# EAGLE schematic Thermal_Stage_rev5 (EAGLE 5.06)

## Sheet 1 of 2
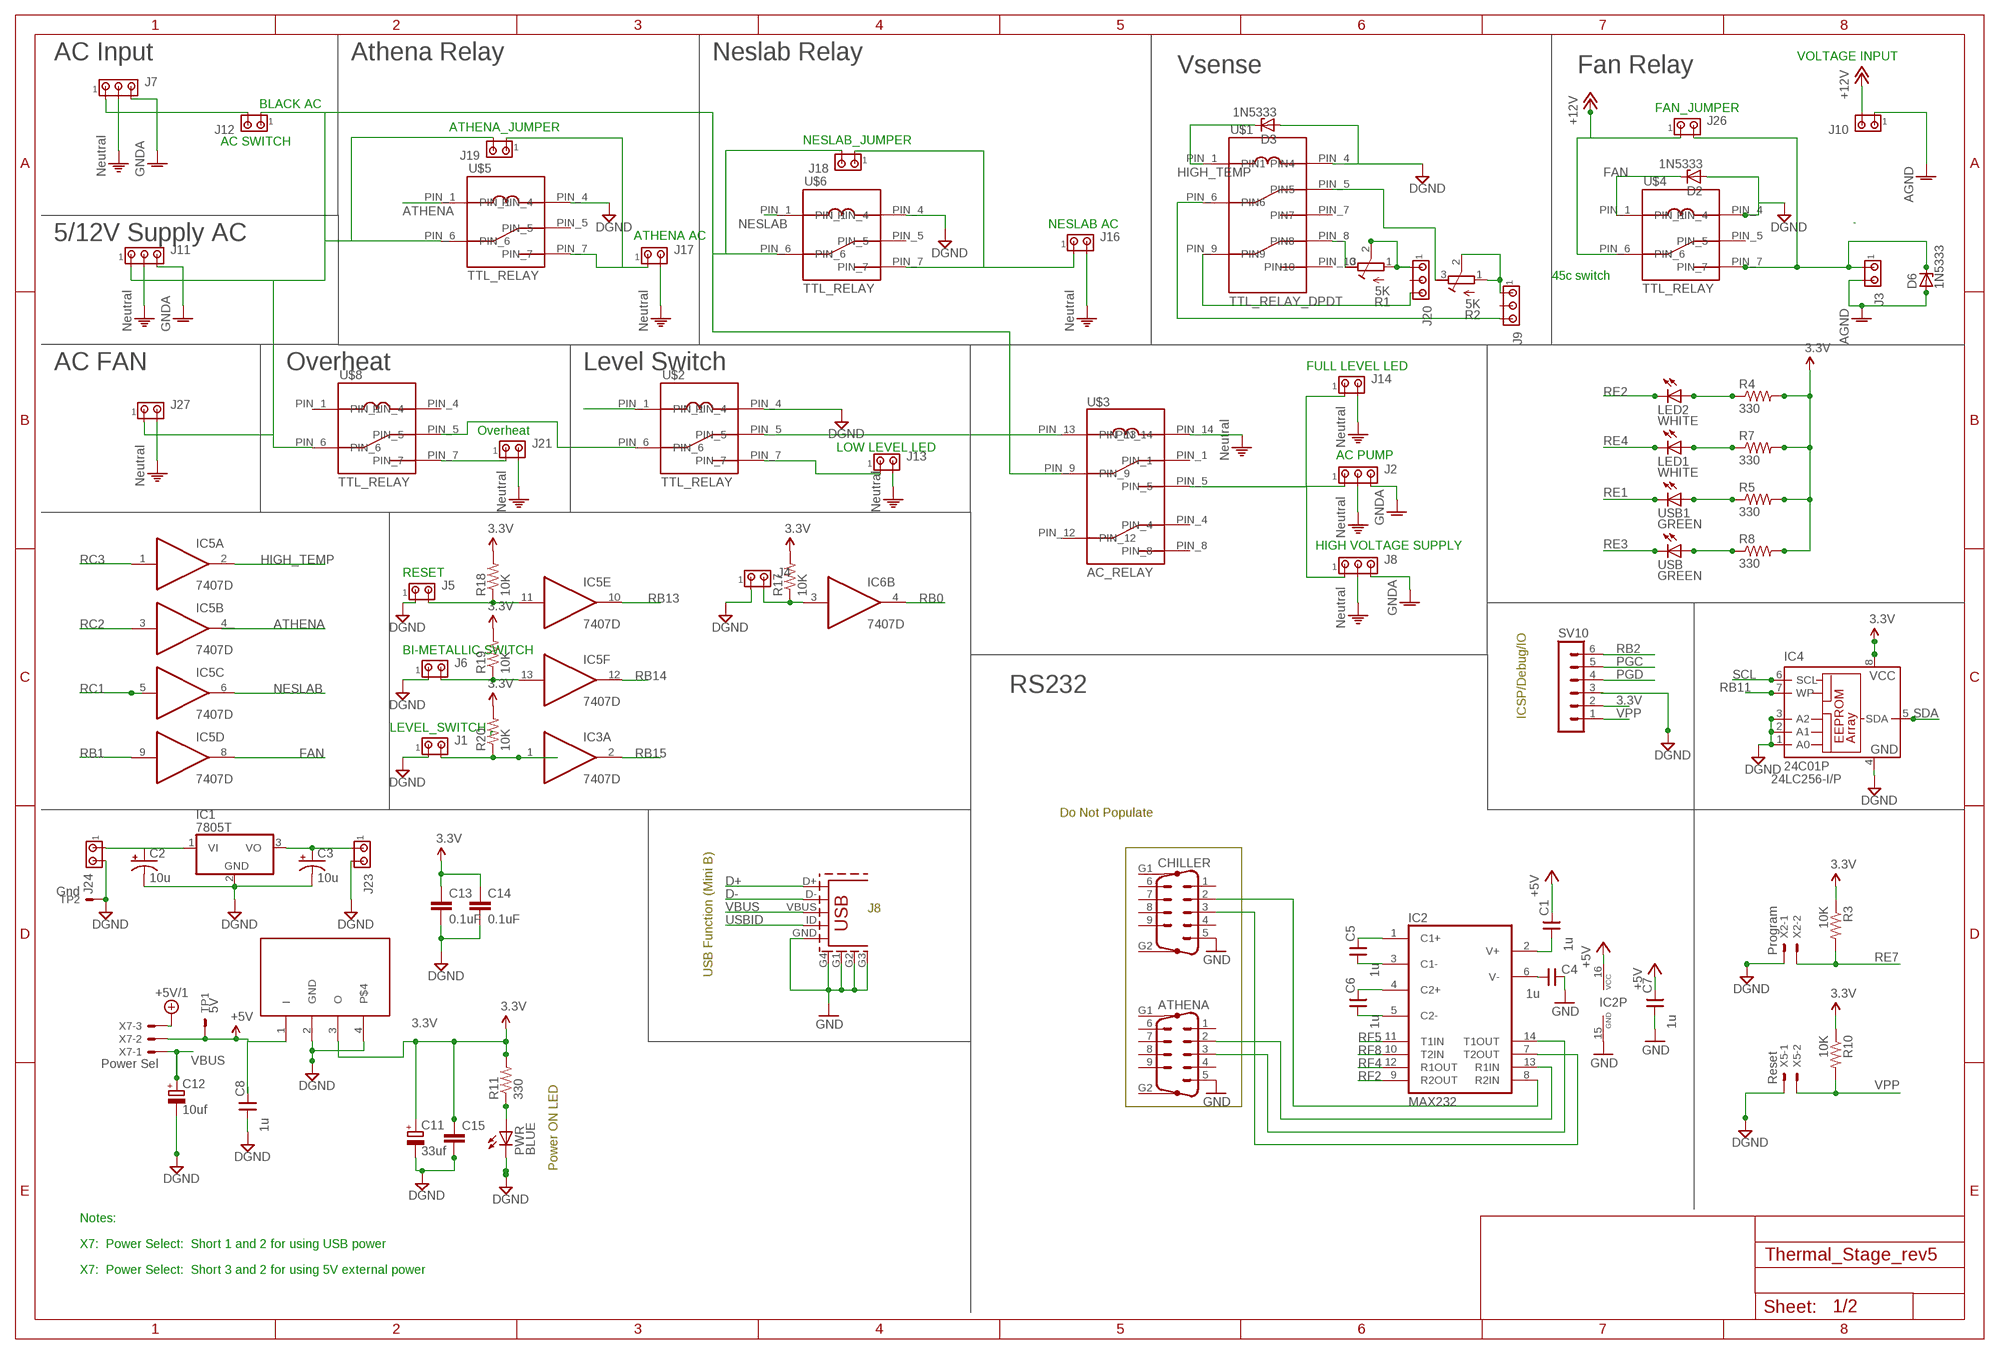
[diagram p0: schematic, sheet 1]

### Parts
ATHENA  M09HP  [M09HP]
C1  1u  CNP-C025-050X025  [C025-050X025]
C2  10u  CPOL-USE2,5-6E  [E2,5-6E]
C3  10u  CPOL-USE2,5-6E  [E2,5-6E]
C4  1u  CNP-C025-050X025  [C025-050X025]
C5  1u  CNP-C025-050X025  [C025-050X025]
C6  1u  CNP-C025-050X025  [C025-050X025]
C7  1u  CNP-C025-050X025  [C025-050X025]
C8  1u  CNP-C025-050X025  [C025-050X025]
C11  33uf  CPOL-EUE5-4  [E5-4]
C12  10uf  CPOL-EUE5-4  [E5-4]
C13  0.1uF  CAP0402  [C0402]
C14  0.1uF  CAP0402-CAP  [0402-CAP]
C15  C5/3  [C5B3]
CHILLER  M09HP  [M09HP]
D2  1N5333  [C1702-15]
D3  1N5333  [C1702-15]
D6  1N5333  [C1702-15]
IC1  7805T  [TO220H]
IC2  MAX232  [DIL16]
IC3  7407D  [SO14]
IC4  24C01P  [DIL8]
IC5  7407D  [SO14]
IC6  7407D  [SO14]
J1  MTA02-156  [1X2MTA]
J2  MTA03-156  [1X3MTA]
J3  MTA02-156  [1X2MTA]
J4  MTA02-156  [1X2MTA]
J5  MTA02-156  [1X2MTA]
J6  MTA02-156  [1X2MTA]
J7  MTA03-156  [1X3MTA]
J8  MTA03-156  [1X3MTA]
J9  MTA03-100  [10X03MTA]
J10  MTA02-156  [1X2MTA]
J11  MTA03-156  [1X3MTA]
J12  MTA02-156  [1X2MTA]
J13  MTA02-156  [1X2MTA]
J14  MTA02-156  [1X2MTA]
J16  MTA02-156  [1X2MTA]
J17  MTA02-156  [1X2MTA]
J18  MTA02-100  [10X02MTA]
J19  MTA02-100  [10X02MTA]
J20  MTA03-100  [10X03MTA]
J21  MTA02-156  [1X2MTA]
J23  MTA02-100  [10X02MTA]
J24  MTA02-100  [10X02MTA]
J26  MTA02-100  [10X02MTA]
J27  MTA02-156  [1X2MTA]
LED1  WHITE  LED0603  [LED-0603]
LED2  WHITE  LED0603  [LED-0603]
PWR  BLUE  LED0603  [LED-0603]
R1  5K  R-TRIMM3296W  [RTRIM3296W]
R2  5K  R-TRIMM3296W  [RTRIM3296W]
R3  10K  RESISTOR0402-RES  [0402-RES]
R4  330  RESISTOR0402-RES  [0402-RES]
R5  330  RESISTOR0402-RES  [0402-RES]
R7  330  RESISTOR0402-RES  [0402-RES]
R8  330  RESISTOR0402-RES  [0402-RES]
R10  10K  RESISTOR0402-RES  [0402-RES]
R11  330  RESISTOR0402-RES  [0402-RES]
R17  10K  RESISTOR0402-RES  [0402-RES]
R18  10K  RESISTOR0402-RES  [0402-RES]
R19  10K  RESISTOR0402-RES  [0402-RES]
R20  10K  RESISTOR0402-RES  [0402-RES]
SV10  MA06-1  [MA06-1]
TP1  5V  TESTPOINT  [TESTPOINT]
TP2  Gnd  TESTPOINT  [TESTPOINT]
U3  USB_5PINB  [USB-MINIB]
U$1  TTL_RELAY_DPDT  [TTL_RELAY_DPDT]
U$2  TTL_RELAY  [R1OS-E1Y1-J1.0K]
U$3  AC_RELAY  [70-402-1]
U$4  TTL_RELAY  [R1OS-E1Y1-J1.0K]
U$5  TTL_RELAY  [R1OS-E1Y1-J1.0K]
U$6  TTL_RELAY  [R1OS-E1Y1-J1.0K]
U$8  TTL_RELAY  [R1OS-E1Y1-J1.0K]
U$9  3.3VREG  [SOT223]
USB  GREEN  LED0603  [LED-0603]
USB1  GREEN  LED0603  [LED-0603]
X2  Program  22-23-2021  [22-23-2021]
X5  Reset  22-23-2021  [22-23-2021]
X7  Power Sel  22-23-2031  [22-23-2031]

### Nets
3.3V: C11.+ C13.1 C14.1 C15.1 IC4.8(VCC) R3.1 R4.2 R5.2 R7.2 R8.2 R10.1 R11.2 R17.2 R18.2 R19.2 R20.2 SV10.2 U$9.3(O) ; also sheet 2
+5V: C1.2 C7.2 C8.2 IC2.16(VCC) TP1.TP(S) U$9.1(I) X7.2
+5V/1: X7.3
+12V: J10.2 J26.1 U$4.PIN_6
AGND: D6.A J3.2 J10.1
ATHENA: U$5.PIN_1
D+: U3.D+ ; also sheet 2
D-: U3.D- ; also sheet 2
DGND: C2.- C3.- C8.1 C11.- C12.- C13.2 C14.2 C15.2 D2.A D3.A IC1.2(GND) IC4.1(A0) IC4.2(A1) IC4.3(A2) IC4.4(GND) J1.1 J4.1 J6.1 J23.2 J24.2 PWR.C TP2.TP(S) U$1.PIN_4(PIN4) U$2.PIN_4 U$4.PIN_4 U$5.PIN_4 U$6.PIN_4 U$9.2(GND) U$9.4 X2.1 X5.1 ; also sheet 2
FAN: D2.C IC5.8(D:O) U$4.PIN_1
GND: ATHENA.5 C4.2 C7.1 CHILLER.5 IC2.15(GND) U3.G1 U3.G2 U3.G3 U3.G4(SHIELD) U3.GND
GNDA: J2.3 J7.3 J8.3 J11.3
HIGH_TEMP: D3.C IC5.2(A:O) U$1.PIN_1(PIN1)
N$1: D6.C J3.1 J26.2 U$4.PIN_7
N$2: J21.1 U$8.PIN_7
N$3: J20.1 R1.1(E) R1.2(S)
N$4: J5.1 ; supply symbol labelled DGND
N$6: U$2.PIN_5 U$3.PIN_13
N$7: R1.3(A) U$1.PIN_8(PIN8)
N$8: J16.1 J18.1 U$6.PIN_7
N$9: IC5.13(F:I) J6.2 R19.1
N$10: IC3.1(A:I) J1.2 R20.1
N$11: C4.1 IC2.6(V-)
N$12: C1.1 IC2.2(V+)
N$13: J9.3 U$1.PIN_6(PIN6)
N$14: J17.1 J19.1 U$5.PIN_7
N$15: U$2.PIN_1
N$16: U$2.PIN_6 U$8.PIN_5
N$18: C5.2 IC2.1(C1+)
N$19: J20.3 U$1.PIN_9(PIN9)
N$20: C5.1 IC2.3(C1-)
N$21: R2.3(A) U$1.PIN_5(PIN5)
N$22: J9.1 R2.1(E) R2.2(S)
N$23: J11.1 J12.1 J18.2 J19.2 J27.1 U$3.PIN_9 U$5.PIN_6 U$6.PIN_6 U$8.PIN_6
N$24: C2.+ IC1.1(VI) J24.1
N$25: C3.+ IC1.3(VO) J23.1
N$26: C6.2 IC2.4(C2+)
N$27: J2.1 J8.1 J14.1 U$3.PIN_5
N$28: J13.1 U$2.PIN_7
N$29: C6.1 IC2.5(C2-)
N$31: J7.1 J12.2
N$32: ATHENA.2 IC2.13(R1IN)
N$33: ATHENA.3 IC2.14(T1OUT)
N$34: CHILLER.2 IC2.8(R2IN)
N$35: CHILLER.3 IC2.7(T2OUT)
N$36: IC5.11(E:I) J5.2 R18.1
N$37: IC6.3(B:I) J4.2 R17.1
N$43: R8.1 USB.A
N$44: LED1.A R7.1
N$45: PWR.A R11.1
N$47: LED2.A R4.1
N$48: R5.1 USB1.A
NESLAB: IC5.6(C:O) U$6.PIN_1
PE: J2.2 J7.2 J8.2 J11.2 J13.2 J14.2 J16.2 J17.2 J21.2 J27.2 U$3.PIN_14 ; supply symbol labelled Neutral
PGC: SV10.5 ; also sheet 2
PGD: SV10.4 ; also sheet 2
RB0: IC6.4(B:O)
RB1: IC5.9(D:I) ; also sheet 2
RB2: SV10.6 ; also sheet 2
RB11: IC4.7(WP) ; also sheet 2
RB13: IC5.10(E:O) ; also sheet 2
RB14: IC5.12(F:O) ; also sheet 2
RB15: IC3.2(A:O) ; also sheet 2
RC1: IC5.5(C:I) ; also sheet 2
RC2: IC5.3(B:I) ; also sheet 2
RC3: IC5.1(A:I) ; also sheet 2
RE1: USB1.C ; also sheet 2
RE2: LED2.C ; also sheet 2
RE3: USB.C ; also sheet 2
RE4: LED1.C ; also sheet 2
RE7: R3.2 X2.2 ; also sheet 2
RF2: IC2.9(R2OUT) ; also sheet 2
RF4: IC2.12(R1OUT) ; also sheet 2
RF5: IC2.11(T1IN) ; also sheet 2
RF8: IC2.10(T2IN) ; also sheet 2
SCL: IC4.6(SCL) ; also sheet 2
SDA: IC4.5(SDA) ; also sheet 2
USBID: U3.ID(USB_ID) ; also sheet 2
VBUS: C12.+ U3.VBUS X7.1 ; also sheet 2
VPP: R10.2 SV10.1 X5.2 ; also sheet 2
Unconnected: ATHENA.1 ATHENA.4 ATHENA.6 ATHENA.7 ATHENA.8 ATHENA.9 ATHENA.G1 ATHENA.G2 CHILLER.1 CHILLER.4 CHILLER.6 CHILLER.7 CHILLER.8 CHILLER.9 CHILLER.G1 CHILLER.G2 IC3.3(B:I) IC3.4(B:O) IC3.5(C:I) IC3.6(C:O) IC3.8(D:O) IC3.9(D:I) IC3.10(E:O) IC3.11(E:I) IC3.12(F:O) IC3.13(F:I) IC5.4(B:O) IC6.1(A:I) IC6.2(A:O) IC6.5(C:I) IC6.6(C:O) IC6.8(D:O) IC6.9(D:I) IC6.10(E:O) IC6.11(E:I) IC6.12(F:O) IC6.13(F:I) J9.2 J20.2 SV10.3 U$1.PIN_7(PIN7) U$1.PIN_10(PIN10) U$3.PIN_1 U$3.PIN_4 U$3.PIN_8 U$3.PIN_12 U$4.PIN_5 U$5.PIN_5 U$6.PIN_5 U$8.PIN_1 U$8.PIN_4

### Notes on the sheet
- AC Input | Athena Relay | Neslab Relay | VOLTAGE INPUT
- Vsense | Fan Relay
- BLACK AC
- FAN_JUMPER
- ATHENA_JUMPER
- AC SWITCH | NESLAB_JUMPER
- NESLAB AC
- 5/12V Supply AC | ATHENA AC
- 45c switch
- AC FAN | Overheat | Level Switch | FULL LEVEL LED
- Overheat
- LOW LEVEL LED
- AC PUMP
- HIGH VOLTAGE SUPPLY
- RESET
- BI-METALLIC SWITCH
- RS232
- ICSP/Debug/IO
- LEVEL_SWITCH
- 24LC256-I/P
- Do Not Populate
- J8
- USB Function (Mini B)
- Power ON LED
- Notes:
- X7:  Power Select:  Short 1 and 2 for using USB power
- X7:  Power Select:  Short 3 and 2 for using 5V external power

## Sheet 2 of 2
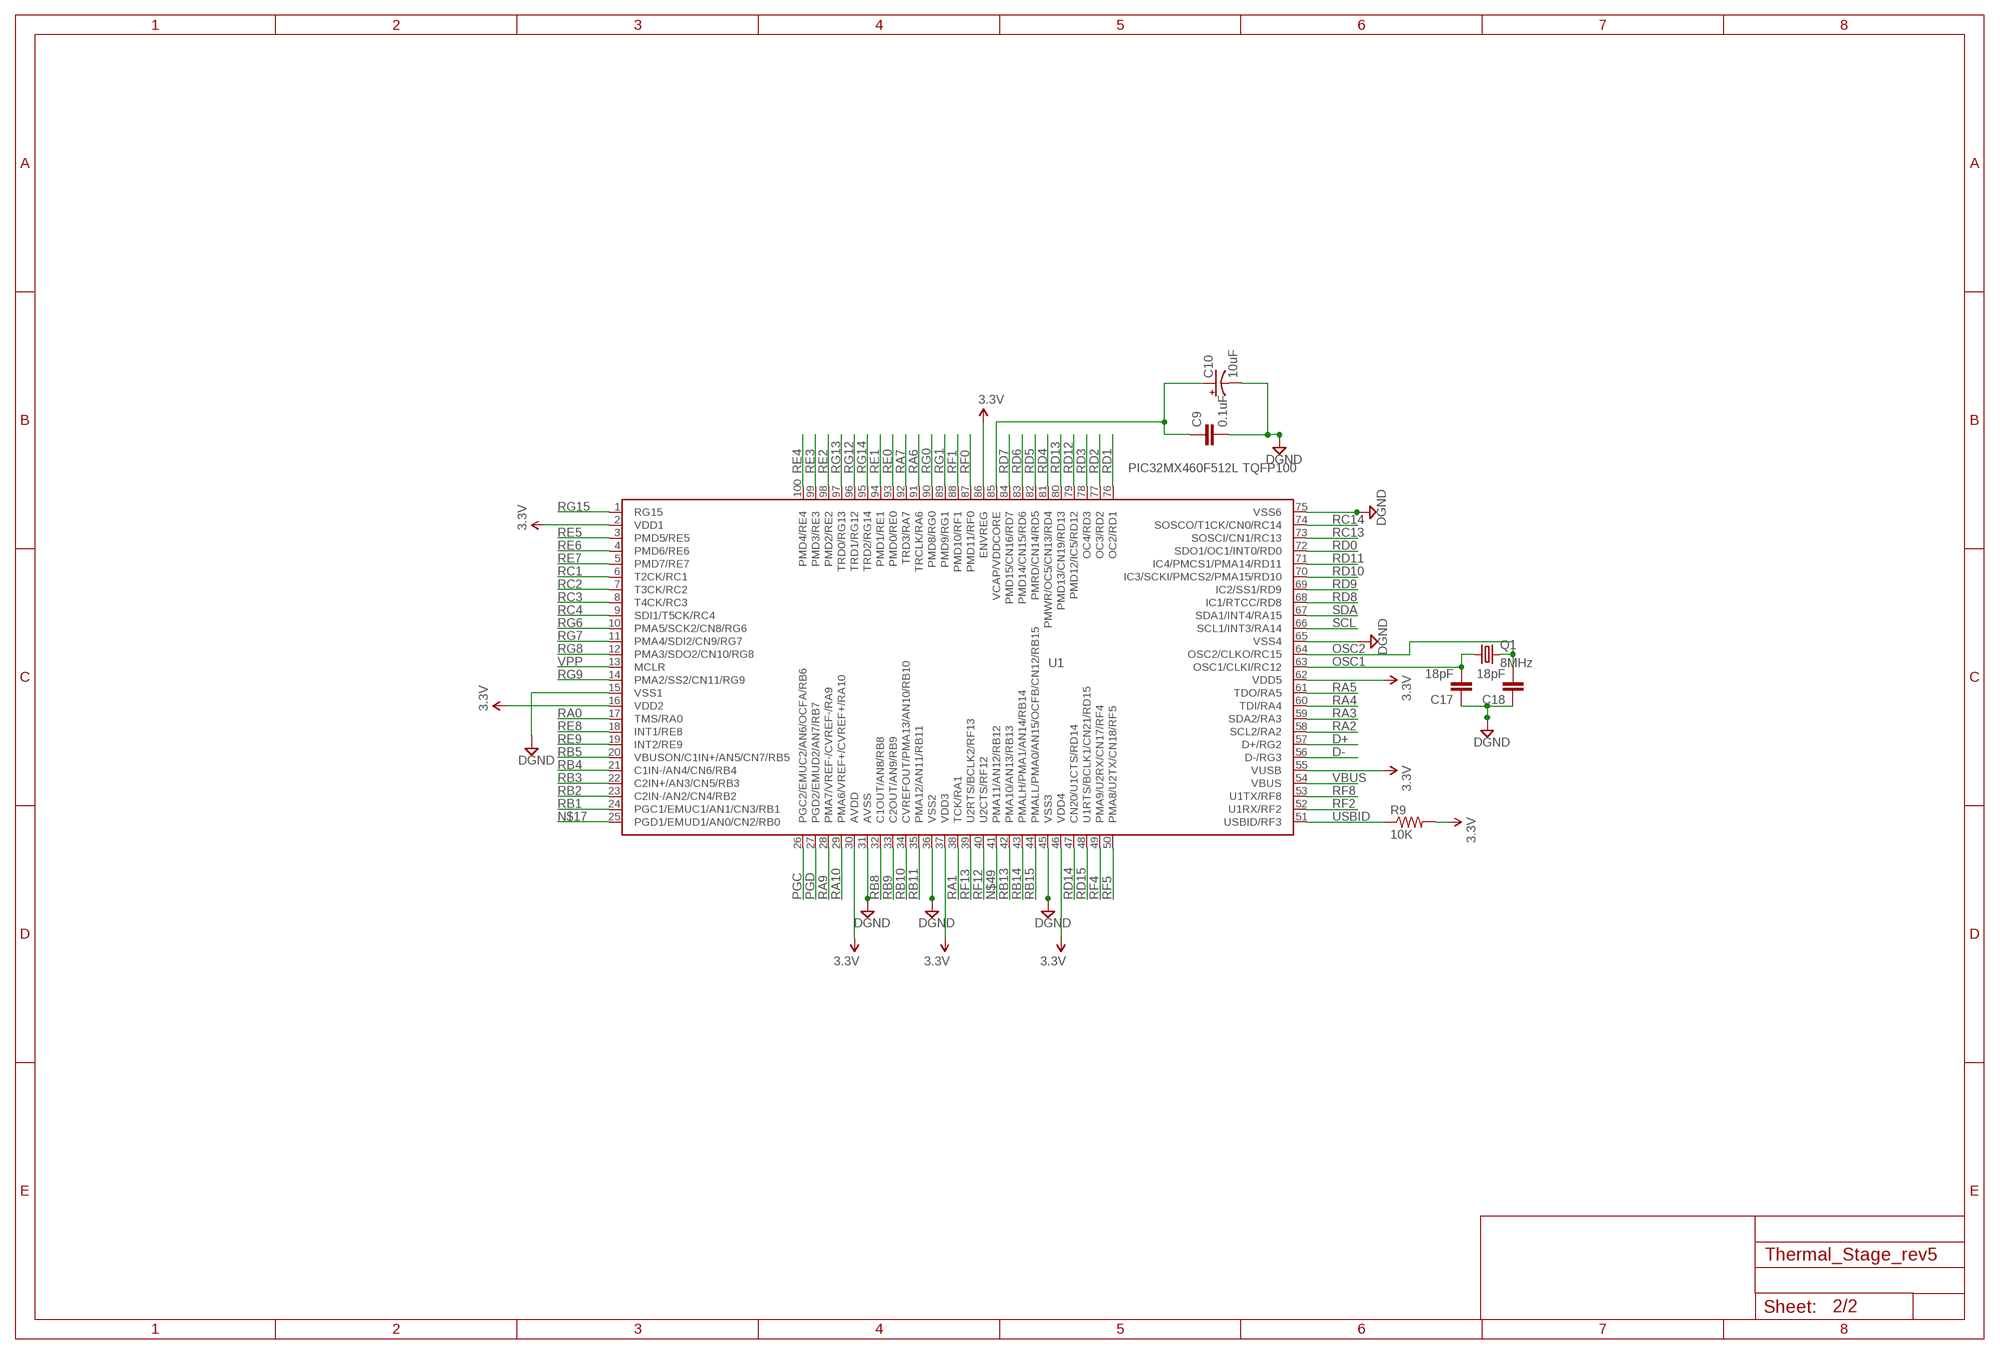
[diagram p1: schematic, sheet 2]

### Parts
C9  0.1uF  CAP0402-CAP  [0402-CAP]
C10  10uF  CAP_POL3528  [EIA3528]
C17  18pF  CAP0402-CAP  [0402-CAP]
C18  18pF  CAP0402-CAP  [0402-CAP]
Q1  8MHz  CRYSTAL5X3  [CRYSTAL-SMD-5X3]
R9  10K  RESISTOR0402-RES  [0402-RES]
U1  PIC32MX460F512L TQFP100  PIC32MX4XXLTQFP100  [TQFP100]

### Nets
3.3V: R9.2 U1.2(VDD1) U1.16(VDD2) U1.30(AVDD) U1.37(VDD3) U1.46(VDD4) U1.55(VUSB) U1.62(VDD5) U1.86(ENVREG) ; also sheet 1
D+: U1.57(D+/RG2) ; also sheet 1
D-: U1.56(D-/RG3) ; also sheet 1
DGND: C9.2 C10.C(-) C17.1 C18.1 U1.15(VSS1) U1.31(AVSS) U1.36(VSS2) U1.45(VSS3) U1.65(VSS4) U1.75(VSS6) ; also sheet 1
N$17: U1.25(PGD1/EMUD1/AN0/CN2/RB0)
N$49: U1.41(PMA11/AN12/RB12)
N$110: C9.1 C10.A(+) U1.85(VCAP/VDDCORE)
OSC1: C17.2 Q1.1 U1.63(OSC1/CLKI/RC12)
OSC2: C18.2 Q1.3 U1.64(OSC2/CLKO/RC15)
PGC: U1.26(PGC2/EMUC2/AN6/OCFA/RB6) ; also sheet 1
PGD: U1.27(PGD2/EMUD2/AN7/RB7) ; also sheet 1
RA0: U1.17(TMS/RA0)
RA1: U1.38(TCK/RA1)
RA2: U1.58(SCL2/RA2)
RA3: U1.59(SDA2/RA3)
RA4: U1.60(TDI/RA4)
RA5: U1.61(TDO/RA5)
RA6: U1.91(TRCLK/RA6)
RA7: U1.92(TRD3/RA7)
RA9: U1.28(PMA7/VREF-/CVREF-/RA9)
RA10: U1.29(PMA6/VREF+/CVREF+/RA10)
RB1: U1.24(PGC1/EMUC1/AN1/CN3/RB1) ; also sheet 1
RB2: U1.23(C2IN-/AN2/CN4/RB2) ; also sheet 1
RB3: U1.22(C2IN+/AN3/CN5/RB3)
RB4: U1.21(C1IN-/AN4/CN6/RB4)
RB5: U1.20(VBUSON/C1IN+/AN5/CN7/RB5)
RB8: U1.32(C1OUT/AN8/RB8)
RB9: U1.33(C2OUT/AN9/RB9)
RB10: U1.34(CVREFOUT/PMA13/AN10/RB10)
RB11: U1.35(PMA12/AN11/RB11) ; also sheet 1
RB13: U1.42(PMA10/AN13/RB13) ; also sheet 1
RB14: U1.43(PMALH/PMA1/AN14/RB14) ; also sheet 1
RB15: U1.44(PMALL/PMA0/AN15/OCFB/CN12/RB15) ; also sheet 1
RC1: U1.6(T2CK/RC1) ; also sheet 1
RC2: U1.7(T3CK/RC2) ; also sheet 1
RC3: U1.8(T4CK/RC3) ; also sheet 1
RC4: U1.9(SDI1/T5CK/RC4)
RC13: U1.73(SOSCI/CN1/RC13)
RC14: U1.74(SOSCO/T1CK/CN0/RC14)
RD0: U1.72(SDO1/OC1/INT0/RD0)
RD1: U1.76(OC2/RD1)
RD2: U1.77(OC3/RD2)
RD3: U1.78(OC4/RD3)
RD4: U1.81(PMWR/OC5/CN13/RD4)
RD5: U1.82(PMRD/CN14/RD5)
RD6: U1.83(PMD14/CN15/RD6)
RD7: U1.84(PMD15/CN16/RD7)
RD8: U1.68(IC1/RTCC/RD8)
RD9: U1.69(IC2/SS1/RD9)
RD10: U1.70(IC3/SCKI/PMCS2/PMA15/RD10)
RD11: U1.71(IC4/PMCS1/PMA14/RD11)
RD12: U1.79(PMD12/IC5/RD12)
RD13: U1.80(PMD13/CN19/RD13)
RD14: U1.47(CN20/U1CTS/RD14)
RD15: U1.48(U1RTS/BCLK1/CN21/RD15)
RE0: U1.93(PMD0/RE0)
RE1: U1.94(PMD1/RE1) ; also sheet 1
RE2: U1.98(PMD2/RE2) ; also sheet 1
RE3: U1.99(PMD3/RE3) ; also sheet 1
RE4: U1.100(PMD4/RE4) ; also sheet 1
RE5: U1.3(PMD5/RE5)
RE6: U1.4(PMD6/RE6)
RE7: U1.5(PMD7/RE7) ; also sheet 1
RE8: U1.18(INT1/RE8)
RE9: U1.19(INT2/RE9)
RF0: U1.87(PMD11/RF0)
RF1: U1.88(PMD10/RF1)
RF2: U1.52(U1RX/RF2) ; also sheet 1
RF4: U1.49(PMA9/U2RX/CN17/RF4) ; also sheet 1
RF5: U1.50(PMA8/U2TX/CN18/RF5) ; also sheet 1
RF8: U1.53(U1TX/RF8) ; also sheet 1
RF12: U1.40(U2CTS/RF12)
RF13: U1.39(U2RTS/BCLK2/RF13)
RG0: U1.90(PMD8/RG0)
RG1: U1.89(PMD9/RG1)
RG6: U1.10(PMA5/SCK2/CN8/RG6)
RG7: U1.11(PMA4/SDI2/CN9/RG7)
RG8: U1.12(PMA3/SDO2/CN10/RG8)
RG9: U1.14(PMA2/SS2/CN11/RG9)
RG12: U1.96(TRD1/RG12)
RG13: U1.97(TRD0/RG13)
RG14: U1.95(TRD2/RG14)
RG15: U1.1(RG15)
SCL: U1.66(SCL1/INT3/RA14) ; also sheet 1
SDA: U1.67(SDA1/INT4/RA15) ; also sheet 1
USBID: R9.1 U1.51(USBID/RF3) ; also sheet 1
VBUS: U1.54(VBUS) ; also sheet 1
VPP: U1.13(MCLR) ; also sheet 1

## Power pins joined to a net without a drawn wire
GND: IC3.7(P:GND) IC5.7(P:GND) IC6.7(P:GND)
VCC: IC3.14(P:VCC) IC5.14(P:VCC) IC6.14(P:VCC)

## Library data of the parts
ATHENA CHILLER = con-subd:M09HP: SUB-D
C1 C4-C8 = cap-master:CNP-: NON-POLARIZED CAP
C2 C3 = rcl:CPOL-US: POLARIZED CAPACITOR, American symbol
C9 C14 C17 C18 = SparkFun:CAP: Capacitor Standard 0603 ceramic capacitor, and 0.1" leaded capacitor.
C10 = SparkFun02-20-08:CAP_POL: Capacitor Polarized These are standard SMD and PTH capacitors. Normally 10uF, 47uF, and 100uF in electrolytic and tantalum varieties. Always verify the external diameter of the through hole cap, it varies with capacity, voltage, and manufacturer. The EIA devices should be standard.
C11 C12 = resistor:CPOL-EU: POLARIZED CAPACITOR, European symbol
C13 = SparkFun02-20-08:CAP: Capacitor Standard 0603 ceramic capacitor, and 0.1" leaded capacitor.
C15 = capacitor-wima:C: CAPACITOR naming: grid - package width
D2 D3 D6 = diode:1N5333: Z DIODE 3.3 V, 5W, 5 percent (Motorola)
IC1 = linear:78*: Positive VOLTAGE REGULATOR Source: http://cache.national.com/ds/LM/LM78L05.pdf http://www.fairchildsemi.com/ds/LM/LM7805.pdf
IC2 = maxim:MAX232: RS232 TRANSEIVER
IC3 IC5 IC6 = 74xx-us:74*07: Hex BUFFER, open collector high-voltage output
IC4 = microchip:24C*: Serial EEPROM 1 K/2 K/4 K
J1 J3-J6 J10 J12-J14 J16 J17 J21 J27 = con-amp:MTA02-156: AMP connector; OC_FARNELL: unknown; OC_NEWARK: unknown
J2 J7 J8 J11 = con-amp:MTA03-156: AMP connector; OC_FARNELL: unknown; OC_NEWARK: unknown
J9 J20 = con-amp:MTA03-100: AMP connector; OC_FARNELL: unknown; OC_NEWARK: unknown
J18 J19 J23 J24 J26 = con-amp:MTA02-100: AMP connector
LED1 LED2 PWR USB USB1 = SparkFun:LED: LEDs Standard schematic elements and footprints for 5mm, 3mm, 1206, and 0603 sized LEDs. 5mm - Spark Fun Electronics SKU : COM-00529 (and others)
Q1 = SparkFun11_03_09:CRYSTAL: Crystals Various standard crystals. Proven footprints. Spark Fun Electronics SKU : COM-00534
R1 R2 = resistor:R-TRIMM: Trimm resistor
R3-R5 R7-R11 R17-R20 = SparkFun:RESISTOR: Resistor Basic schematic elements and footprints for 0603, 1206, and PTH 1/10th watt (small) resistors.
SV10 = con-lstb:MA06-1: PIN HEADER
TP1 TP2 = OMX-MIX:TESTPOINT
U1 = SchmalzHaus:PIC32MX4XXL
U3 = OMX-MIX:USB_5PIN
U$1 = Anthony-Relay:TTL_RELAY_DPDT
U$2 U$4-U$6 U$8 = Anthony-Relay:TTL_RELAY
U$3 = Anthony-Relay:AC_RELAY
U$9 = SparkFun:3.3VREG
X2 X5 = con-molex:22-23-2021: .100" (2.54mm) Center Header - 2 Pin
X7 = con-molex:22-23-2031: .100" (2.54mm) Center Header - 3 Pin